# EAGLE design RN41_Rootooth (EAGLE 6.4)
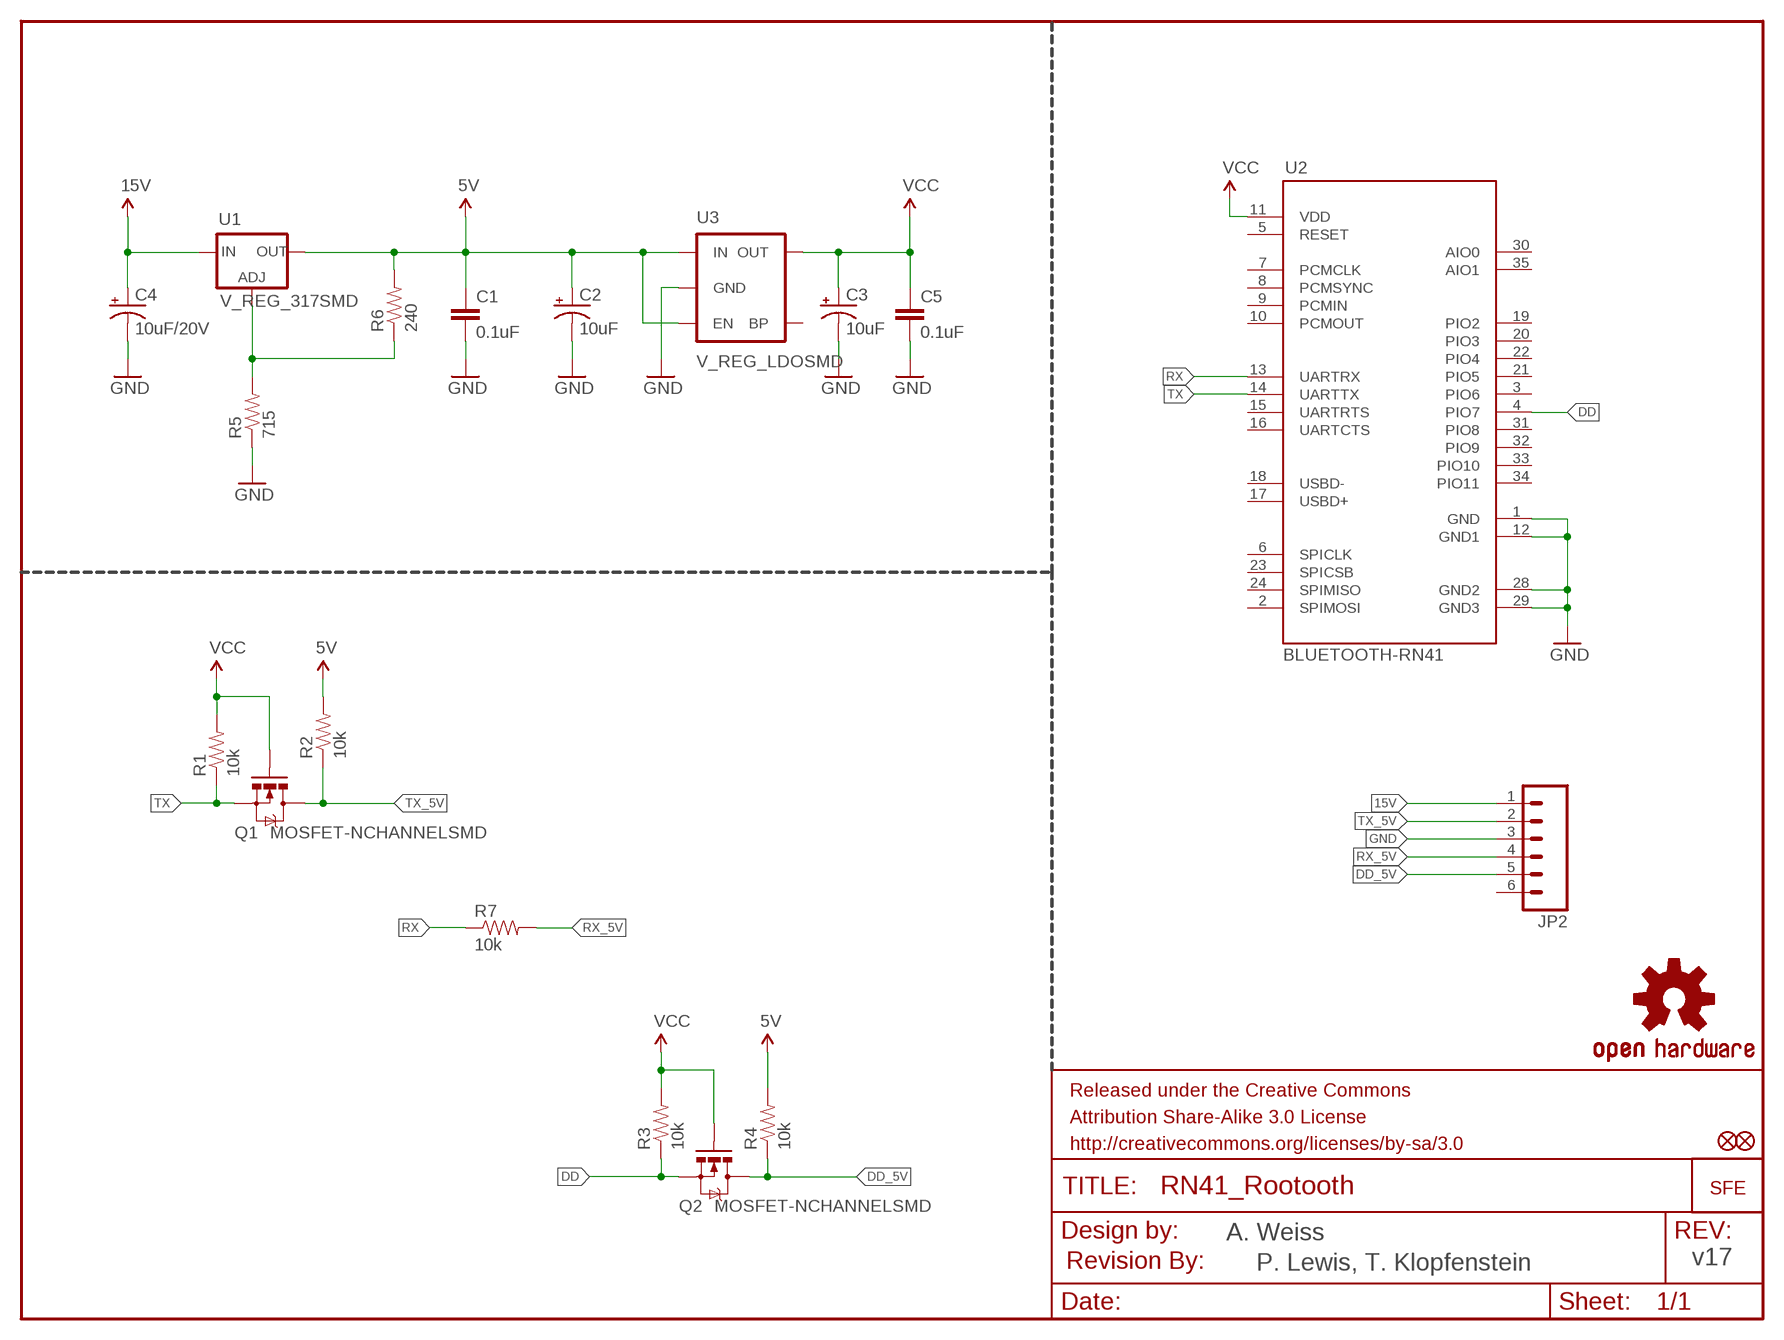
[diagram p0: schematic, sheet 1]

## Parts
C1  0.1uF  CAP0603-CAP  [0603-CAP]
C2  10uF  CAP_POL1206  [EIA3216]
C3  10uF  CAP_POL1206  [EIA3216]
C4  10uF/20V  CAP_POL3528  [EIA3528]
C5  0.1uF  CAP0603-CAP  [0603-CAP]
FRAME1  FRAME-LETTER  [CREATIVE_COMMONS]
JP1  FIDUCIALUFIDUCIAL  [MICRO-FIDUCIAL]
JP2  M06SMD  [1X06-SMD]
JP3  FIDUCIALUFIDUCIAL  [MICRO-FIDUCIAL]
LOGO1  OSHW-LOGOS  [OSHW-LOGO-S]
Q1  MOSFET-NCHANNELSMD  [SOT23-3]
Q2  MOSFET-NCHANNELSMD  [SOT23-3]
R1  10k  RESISTOR0603-RES  [0603-RES]
R2  10k  RESISTOR0603-RES  [0603-RES]
R3  10k  RESISTOR0603-RES  [0603-RES]
R4  10k  RESISTOR0603-RES  [0603-RES]
R5  715  RESISTOR0603-RES  [0603-RES]
R6  240  RESISTOR0603-RES  [0603-RES]
R7  10k  RESISTOR0603-RES  [0603-RES]
U1  V_REG_317SMD  [SOT223]
U2  BLUETOOTH-RN41  BLUETOOTH-RN41"  [RN41]
U3  V_REG_LDOSMD  [SOT23-5]
U$1  LOGO-SFENEW  [SFE-NEW-WEBLOGO]
U$2  REVISION  [REVISION]

## Nets
5V: C1.1 C2.A(+) R2.2 R4.2 R6.2 U1.2(OUT) U3.1(IN) U3.3(EN)
15V: C4.A(+) JP2.1 U1.3(IN)
DD: Q2.2(S) R3.1 U2.4(PIO7)
DD_5V: JP2.5 Q2.3(D) R4.1
GND: C1.2 C2.C(-) C3.C(-) C4.C(-) C5.2 JP2.3 R5.1 U2.1(GND) U2.12(GND1) U2.28(GND2) U2.29(GND3) U3.2(GND)
N$2: R5.2 R6.1 U1.1(ADJ)
RX: R7.1 U2.13(UARTRX)
RX_5V: JP2.4 R7.2
TX: Q1.2(S) R1.1 U2.14(UARTTX)
TX_5V: JP2.2 Q1.3(D) R2.1
VCC: C3.A(+) C5.1 Q1.1(G) Q2.1(G) R1.2 R3.2 U2.11(VDD) U3.5(OUT)
Unconnected: JP2.6 U2.2(SPIMOSI) U2.3(PIO6) U2.5(RESET) U2.6(SPICLK) U2.7(PCMCLK) U2.8(PCMSYNC) U2.9(PCMIN) U2.10(PCMOUT) U2.15(UARTRTS) U2.16(UARTCTS) U2.17(USBD+) U2.18(USBD-) U2.19(PIO2) U2.20(PIO3) U2.21(PIO5) U2.22(PIO4) U2.23(SPICSB) U2.24(SPIMISO) U2.30(AIO0) U2.31(PIO8) U2.32(PIO9) U2.33(PIO10) U2.34(PIO11) U2.35(AIO1) U3.4(BP)

## Notes on the sheet
- A. Weiss
- P. Lewis, T. Klopfenstein | v17

## Library data of the parts
C1 C5 = SparkFun:CAP: Capacitor Standard 0603 ceramic capacitor, and 0.1" leaded capacitor.
C2-C4 = SparkFun:CAP_POL: Capacitor Polarized These are standard SMD and PTH capacitors. Normally 10uF, 47uF, and 100uF in electrolytic and tantalum varieties. Always verify the external diameter of the through hole cap, it varies with capacity, voltage, and manufacturer. The EIA devices should be standard.
FRAME1 = SparkFun-Aesthetics:FRAME-LETTER: Schematic Frame Standard 8.5x11 US Letter frame
JP1 JP3 = SparkFun:FIDUCIAL: Fiducial Alignment Points Various fiducial points for machine vision alignment.
JP2 = SparkFun:M06: Header 6 Standard 6-pin 0.1" header. Use with straight break away headers (SKU : PRT-00116), right angle break away headers (PRT-00553), swiss pins (PRT-00743), machine pins (PRT-00117), and female headers (PRT-00115). Molex polarized connector foot print use with SKU : PRT-08094 with associated crimp pins and housings. NOTES ON THE VARIANTS LOCK and LOCK_LONGPADS... This footprint was designed to help hold the alignment of a through-hole component (i.e. 6-pin header) while soldering it into place. You may notice that each hole has been shifted either up or down by 0.005 of an inch from it's more standard position (which is a perfectly straight line). This slight alteration caused the pins (the squares in the middle) to touch the edges of the holes. Because they are alternating, it causes a "brace" to hold the component in place. 0.005 has proven to be the perfect amount of "off-center" position when using our standard breakaway headers. Although looks a little odd when you look at the bare footprint, once you have a header in there, the alteration is very hard to notice. Also, if you push a header all the way into place, it is covered up entirely on the bottom side. This idea of altering the position of holes to aid alignment will be further integrated into the Sparkfun Library for other footprints. It can help hold any component with 3 or more connection pins.
LOGO1 = SparkFun-Aesthetics:OSHW-LOGO: Open Source Hardware Logo This logo indicates the piece of hardware it is found on incorporates a OSHW license and/or adheres to the definition of open source hardware found here: http://freedomdefined.org/OSHW
Q1 Q2 = SparkFun:MOSFET-NCHANNEL
R1-R7 = SparkFun:RESISTOR: Resistor Basic schematic elements and footprints for 0603, 1206, and PTH 1/10th watt (small) resistors.
U1 = SparkFun:V_REG_317: Voltage Regulator Standard LM317 adjustable voltage regulator. AOI (Adjust Output Input). Google 'LM317 Calculator' for easy to use app to get the two resistor values needed. 240/720 for 5V output. 240/390 for 3.3V output. Spark Fun Electronics SKU : COM-00527
U2 = SparkFun-RF:BLUETOOTH-RN41: Bluetooth SMD module
U3 = SparkFun:V_REG_LDO: Voltage Regulator LDO Standard 150mA LDO voltage regulator in SOT-23 layout. Micrel part MIC5205. BP (by-pass) pin is used to lower output noise with 470pF cap.
U$1 = SparkFun:LOGO-SFE: Spark Fun Electronics PCB Logo This is the standard Spark Fun Electronics PCB logo.
U$2 = SparkFun-Aesthetics:REVISION

## Board
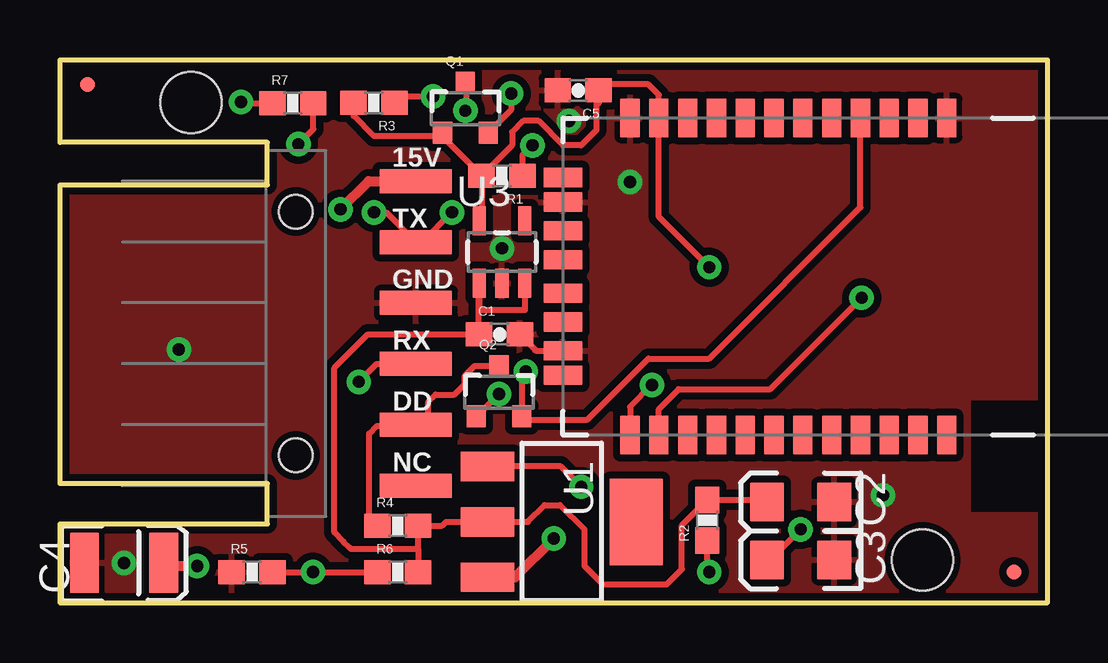
[diagram p1: board, top side]
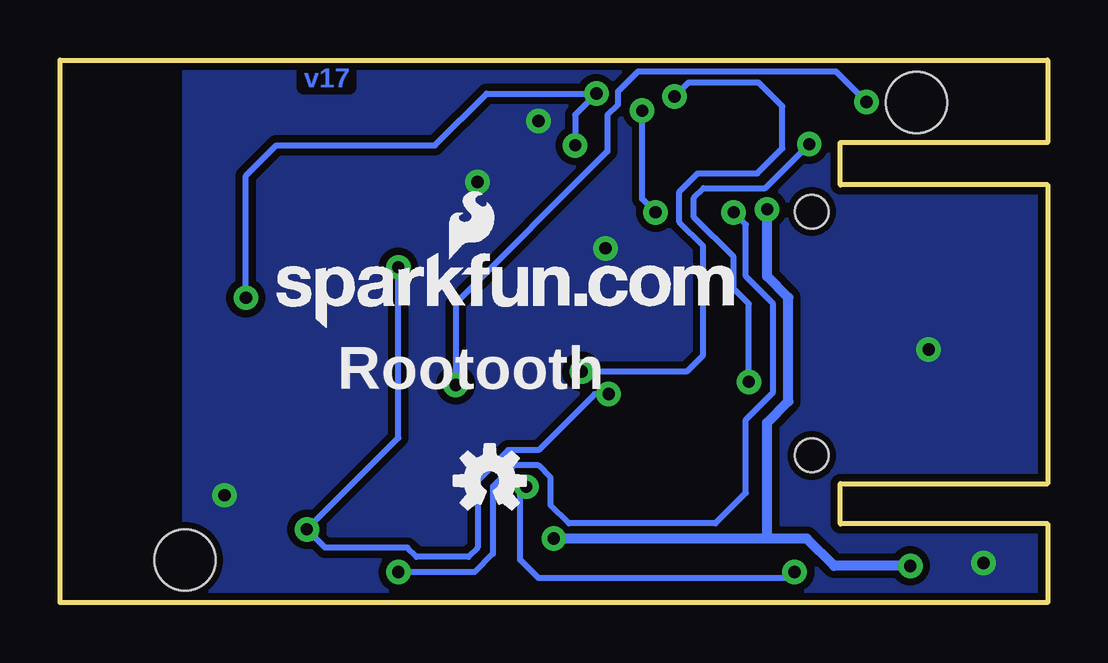
[diagram p2: board, bottom side, seen from below]

Size 41.15 x 22.61 mm. Coordinates in mm from the lower left corner, seen from the top.
Outline: 0,0 41.15,0 41.15,22.61 0,22.61 0,19.18 8.64,19.18 8.64,17.4 0,17.4 0,4.95 8.64,4.95 8.64,3.28 0,3.28 0,0
Copper layers (1*16): Top 0.035mm / dielectric 1.5mm / Bottom 0.035mm
Design rules "SparkFun *": minimum track width 8mil, minimum drill 20mil, track to track 8mil, track to pad 8mil, pad to pad 8mil, via to via 8mil, smd to smd 8mil, copper to edge 10mil, drill to drill 8mil, minimum pad ring 12mil, minimum via ring 10mil, stop-mask expansion 4mil, vias tented up to drill 25mil, thermal gap 10mil
Holes 2.54 mm at 35.94,1.78 5.46,20.83

### Footprints (pad centres in the part's own frame; a part is rotated, then mirrored left to right if it is on the bottom)
0603-CAP = smd 1.1 x 1: 1 -0.85,0; 2 0.85,0
EIA3216 = smd 1.4 x 1.6: A 1.4,0; C -1.4,0
EIA3528 = smd 1.2 x 2.5: A 1.65,0; C -1.65,0
MICRO-FIDUCIAL = smd 0.635 x 0.635: 1 0,0
1X06-SMD = smd 1 x 3: 1 -6.35,5; 2 -3.81,5; 3 -1.27,5; 4 1.27,5; 5 3.81,5; 6 6.35,5 | hole 1.4: -5.08,0; 5.08,0
SOT23-3 = smd 0.8 x 0.9: 1 -0.95,-1; 2 0.95,-1; 3 0,1.1
0603-RES = smd 1.1 x 1: 1 -0.85,0; 2 0.85,0
SOT223 = smd 1.219 x 2.235: 1 -2.311,-3.099; 2 0,-3.099; 3 2.311,-3.099 | smd 3.6 x 2.2: 4 0,3.099
RN41 = smd 0.8 x 1.6: 1 -6.6,-6.6; 2 -5.4,-6.6; 3 -4.2,-6.6; 4 -3,-6.6; 5 -1.8,-6.6; 6 -0.6,-6.6; 7 0.6,-6.6; 8 1.8,-6.6; 9 3,-6.6; 10 4.2,-6.6; 11 5.4,-6.6; 12 6.6,-6.6; 13 6.6,6.6; 14 5.4,6.6; 15 4.2,6.6; 16 3,6.6; 17 1.8,6.6; 18 0.6,6.6; 19 -0.6,6.6; 20 -1.8,6.6; 21 -3,6.6; 22 -4.2,6.6; 23 -5.4,6.6; 24 -6.6,6.6 | smd 1.6 x 0.8: 28 9.4,3.1; 29 9.4,-3.1; 30 9.4,4.122; 31 9.4,1.9; 32 9.4,0.7; 33 9.4,-0.7; 34 9.4,-1.9; 35 9.4,-4.122
SOT23-5 = smd 0.55 x 1.2: 1 -0.95,-1.3; 2 0,-1.3; 3 0.95,-1.3; 4 0.95,1.3; 5 -0.95,1.3

### Placement (x,y rotation side)
C1  18.31,11.18 0 top
C2  30.86,4.19 180 top
C3  30.86,1.78 180 top
C4  2.67,1.65 0 top
C5  21.59,21.34 180 top
FRAME1  -5.38,-11.43 0 top  (outside the outline)
JP1  1.14,21.59 0 top
JP2  9.82,11.21 270 top
JP3  39.75,1.27 0 top
LOGO1  23.24,5.08 0 bottom
Q1  16.89,20.57 0 top
Q2  18.29,8.76 0 top
R1  18.41,17.78 180 top
R2  26.97,3.43 90 top
R3  13.08,20.83 180 top
R4  14.07,3.2 0 top
R5  8,1.27 0 top
R6  14.07,1.27 0 top
R7  9.7,20.8 0 top
U1  20.91,3.36 270 top
U2  30.35,13.59 180 top
U3  18.41,14.61 0 top
U$1  32.13,11.43 0 bottom
U$2  6.1,-14.22 0 top  (outside the outline)

### Tracks (layer width: path | path; a pad name or v marks a point on that pad's centre or on a via)
5V
  Top 0.254: 17.44,11.18 C1.1 | 17.44,11.18 17.44,13.28 U3.1 17.46,12.19 19.38,12.19 19.38,13.3 U3.3 | 17.44,11.18 12.83,11.18 11.43,9.78 11.43,2.92 11.81,2.54 12.06,2.29 12.12,2.23 14.92,2.23 | C2.A 29.37,4.28 R2.2 25.91,3.21 25.91,1.4 25.27,0.76 22.61,0.76 21.84,1.52 21.84,3.05 20.83,4.06 20.19,4.06 19.49,3.36 U1.2 16.09,3.36 15.93,3.2 R4.2 14.92,2.23 | 14.92,2.23 R6.2
15V  (via drill 0.51)
  Top 0.406: JP2.1 12.86,17.56 v11.68,16.38 | U1.3 18.96,1.05 v20.57,2.67 | v5.71,1.52 4.19,1.52 C4.A
  Bottom 0.406: 11.81,2.67 10.03,2.67 8.89,1.52 v5.71,1.52 | 11.81,2.67 v20.57,2.67 | v11.68,16.38 11.68,13.59 10.79,12.7 10.79,8.38 11.68,7.49 11.68,2.79 11.81,2.67
DD  (via drill 0.51)
  Top 0.254: v19.41,9.63 19.24,9.46 Q2.2 19.38,7.62 21.97,7.62 24.51,10.16 27.05,10.16 33.35,16.46 U2.4 | v15.54,21.08 14.18,21.08 R3.1
  Bottom 0.254: v19.41,9.63 15.04,9.63 14.35,10.31 14.35,14.86 15.34,15.85 15.34,17.12 14.58,17.88 12.09,17.88 11.05,18.92 11.05,20.68 12.04,21.67 14.96,21.67 v15.54,21.08
DD_5V
  Top 0.254: 15.35,7.4 JP2.5 14.79,7.37 13.21,7.37 12.88,7.04 12.88,3.54 R4.1 | 15.35,7.4 15.35,8.37 15.65,8.66 16.43,8.66 16.87,9.09 16.87,9.45 17.28,9.86 Q2.3 | 15.35,7.4 15.73,7.02 | 15.35,7.4 15.34,7.39
GND  (via drill 0.51)
  Top 0.254: U2.28 19.85,10.49 C1.2
  other vias: 2.67,1.65 4.95,10.54 21.21,20.07 34.29,4.47 23.75,17.53 18.41,14.76
  pour Top (isolate 0.305): 0,0 0,22.61 41.15,22.61 41.15,8.51 37.85,8.51 37.85,3.68 41.15,3.68 41.15,0
  pour Bottom (isolate 0.305): 0,22.61 0,0 35.94,0 35.94,22.61
N$2  (via drill 0.51)
  Top 0.254: R5.2 v10.54,1.27 R6.1 | U1.1 20.87,5.67 v21.72,4.83
  Bottom 0.254: v10.54,1.27 10.79,1.02 21.21,1.02 21.97,1.78 21.97,4.57 v21.72,4.83
RX  (via drill 0.51)
  Top 0.254: U2.13 23.75,8.16 v24.66,9.07 | R7.1 7.6,20.8 v7.54,20.85
  Bottom 0.254: v24.66,9.07 24.66,12.47 18.34,18.8 18.34,20.32 17.91,20.75 17.91,21.29 17.07,22.12 8.81,22.12 v7.54,20.85
RX_5V  (via drill 0.51)
  Top 0.254: v9.93,19.1 10.55,19.72 R7.2 | JP2.4 13.19,9.94 v12.45,9.2
  Bottom 0.254: v9.93,19.1 11.76,17.27 14.33,17.27 14.73,16.87 14.73,16.05 13.08,14.4 13.08,13.08 12.45,12.45 v12.45,9.2
TX  (via drill 0.51)
  Top 0.254: v33.4,12.7 29.59,8.89 25.78,8.89 24.95,8.06 U2.14 | v18.8,21.21 18.8,20.53 Q1.2 | R1.1 19.27,18.63 v19.68,19.05
  Bottom 0.254: v33.4,12.7 33.4,17.78 32.13,19.05 25.53,19.05 23.37,21.21 v18.8,21.21 19.68,20.32 v19.68,19.05
TX_5V  (via drill 0.51)
  Top 0.254: R2.1 26.97,1.35 arc90 v27.05,1.27 | Q1.3 16.94,21.62 16.94,20.55 v16.89,20.5 | v13.08,16.26 13.59,16.26 JP2.2 15.1,15.02 v16.33,16.26
  Bottom 0.254: v27.05,1.27 23.88,1.27 23.11,2.03 23.11,4.83 22.22,5.71 21.21,5.71 20.7,5.21 20.7,4.06 19.94,3.3 13.84,3.3 12.57,4.57 12.57,7.62 11.43,8.76 11.43,12.45 12.57,13.59 12.57,15.75 v13.08,16.26 | v16.89,20.5 16.89,16.82 v16.33,16.26
VCC  (via drill 0.51)
  Top 0.254: C5.1 22.69,21.59 24.51,21.59 24.95,21.15 U2.11 24.95,16.07 v27.05,13.97 | C5.1 22.44,20.79 | R1.2 18.84,19.05 18.84,19.6 19.3,20.07 19.94,20.07 20.95,19.05 21.72,19.05 22.35,19.68 22.35,21.25 C5.1 | R1.2 15.94,19.4 Q1.1 15.8,19.43 13.08,19.43 12.23,20.28 R3.2 | Q2.1 17.34,7.81 17.41,7.81 v18.29,8.69 | C3.A 29.59,1.78 v30.86,3.05 | R1.2 17.57,16 U3.5
  Bottom 0.254: v18.29,8.69 18.87,8.69 21.21,6.35 22.48,6.35 23.75,5.08 23.75,2.29 24.13,1.91 26.29,1.91 26.67,2.29 30.1,2.29 v30.86,3.05 27.05,6.86 v27.05,13.97

### Text on the board
Bottom: v17
tPlace: 15V | TX | GND | RX | DD | NC
bPlace: Rootooth
tValues: LM317 | A. Weiss | P. Lewis, T. Klopfenstein
201bmp: C:/Documents and Settings/plewis/My Documents/My Pictures/rootooth/DSCF5275.bmp